# EAGLE design simple-loop-vrs (EAGLE 6.6.0)

## Sheet 1 of 2
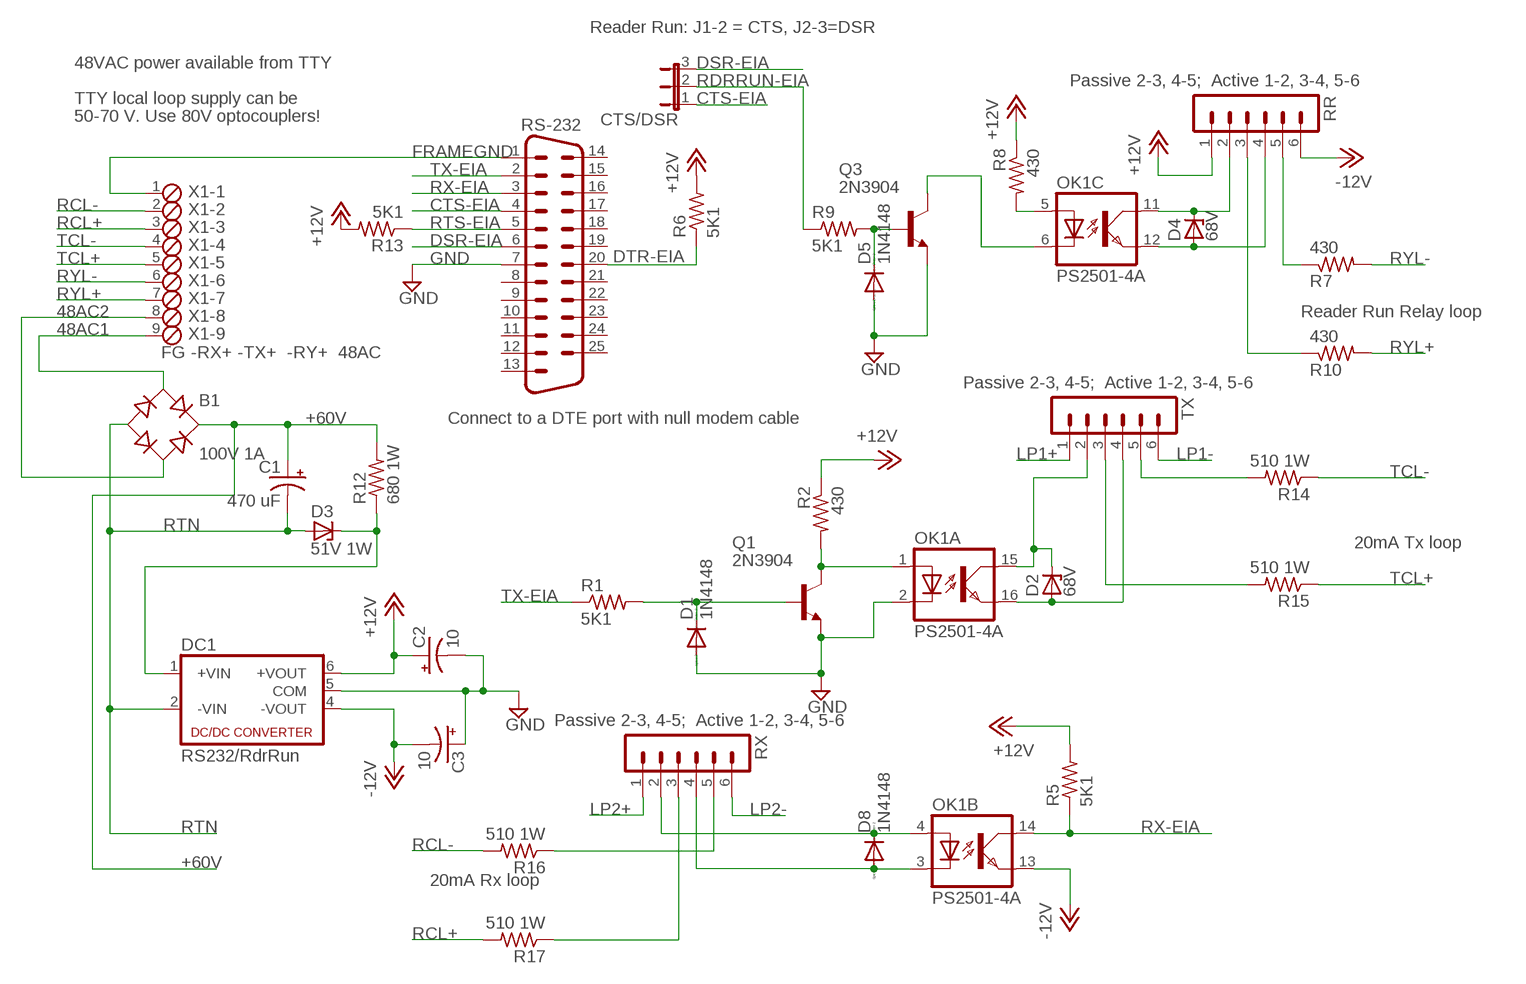
[diagram p0: schematic, sheet 1]

### Parts
B1  100V 1A  RB1A  [RB1A]
C1  470 uF  CPOL-USE7.5-18  [E7,5-18]
C2  10  CPOL-USB45181A  [B45181A]
C3  10  CPOL-USB45181A  [B45181A]
CTS/DSR  JP2E  [JP2]
D1  1N4148  1N4148DO35-10  [DO35-10]
D2  68V  ZENER-DIODEDO41Z10  [DO41Z10]
D3  51V 1W  ZENER-DIODEDO41Z10  [DO41Z10]
D4  68V  ZENER-DIODEDO41Z10  [DO41Z10]
D5  1N4148  1N4148DO35-10  [DO35-10]
D8  1N4148  1N4148DO35-10  [DO35-10]
DC1  RS232/RdrRun  NMA  [NMA]
OK1  PS2501-4A  ILQ1  [DIL16]
Q1  2N3904  [TO92]
Q3  2N3904  [TO92]
R1  5K1  R-US_0207/10  [0207/10]
R2  430  R-US_0207/10  [0207/10]
R5  5K1  R-US_0207/10  [0207/10]
R6  5K1  R-US_0207/10  [0207/10]
R7  430  R-US_0207/10  [0207/10]
R8  430  R-US_0207/10  [0207/10]
R9  5K1  R-US_0207/10  [0207/10]
R10  430  R-US_0207/10  [0207/10]
R12  680 1W  R-US_0817/7V  [P0817V]
R13  5K1  R-US_0207/10  [0207/10]
R14  510 1W  R-US_0817/7V  [P0817V]
R15  510 1W  R-US_0817/7V  [P0817V]
R16  510 1W  R-US_0817/7V  [P0817V]
R17  510 1W  R-US_0817/7V  [P0817V]
RR  MA06-1  [MA06-1]
RS-232  M25H  [M25H]
RX  MA06-1  [MA06-1]
TX  MA06-1  [MA06-1]
X1  FG -RX+ -TX+ -RY+ 48AC  MPT9  [9POL254]

### Nets
48AC1: B1.AC1 X1.9
48AC2: B1.AC2 X1.8
+12V: C2.+ DC1.6(+VOUT) R2.1 R5.2 R6.2 R8.1 R13.2 RR.1
+48VDC: D3.C DC1.1(+VIN) R12.1
+60V: B1.+ C1.+ R12.2 ; also sheet 2
-12V: C3.- DC1.4(-VOUT) OK1.13(B:EMIT) RR.6
CTS-EIA: CTS/DSR.1 RS-232.4
DSR-EIA: CTS/DSR.3 RS-232.6
DTR-EIA: R6.1 RS-232.20
FRAMEGND: RS-232.1 X1.1
GND [GND]: C2.- C3.+ D1.A D5.A DC1.5(COM) OK1.2(A:C) Q1.3(E) Q3.3(E) RS-232.7
LP1+: TX.1 ; also sheet 2
LP1-: TX.6 ; also sheet 2
LP2+: RX.1 ; also sheet 2
LP2-: RX.6 ; also sheet 2
N$1: D8.C OK1.4(B:A) RX.2
N$2: R16.1 RX.5
N$3: D8.A OK1.3(B:C) RX.4
N$4: D2.A OK1.16(A:EMIT) TX.4
N$5: OK1.5(C:A) R8.2
N$6: D2.C OK1.15(A:COL) TX.2
N$7: D1.C Q1.2(B) R1.2
N$8: D4.C OK1.11(C:COL) RR.2
N$9: OK1.1(A:A) Q1.1(C) R2.2
N$10: R10.1 RR.3
N$11: R7.1 RR.5
N$15: OK1.6(C:C) Q3.1(C)
N$16: D5.C Q3.2(B) R9.2
N$19: R14.2 TX.5
N$20: R17.1 RX.3
N$21: R15.2 TX.3
N$22: D4.A OK1.12(C:EMIT) RR.4
RCL+: R17.2 X1.3
RCL-: R16.2 X1.2
RDRRUN-EIA: CTS/DSR.2 R9.1
RTN: B1.- C1.- D3.A DC1.2(-VIN) ; also sheet 2
RTS-EIA: R13.1 RS-232.5
RX-EIA: OK1.14(B:COL) R5.1 RS-232.3
RYL+: R10.2 X1.7
RYL-: R7.2 X1.6
TCL+: R15.1 X1.5
TCL-: R14.1 X1.4
TX-EIA: R1.1 RS-232.2
Unconnected: RS-232.8 RS-232.9 RS-232.10 RS-232.11 RS-232.12 RS-232.13 RS-232.14 RS-232.15 RS-232.16 RS-232.17 RS-232.18 RS-232.19 RS-232.21 RS-232.22 RS-232.23 RS-232.24 RS-232.25

### Notes on the sheet
- Reader Run: J1-2 = CTS, J2-3=DSR
- 48VAC power available from TTY
- Passive 2-3, 4-5;  Active 1-2, 3-4, 5-6
- TTY local loop supply can be
- 50-70 V. Use 80V optocouplers!
- Reader Run Relay loop
- Passive 2-3, 4-5;  Active 1-2, 3-4, 5-6
- Connect to a DTE port with null modem cable
- 20mA Tx loop
- Passive 2-3, 4-5;  Active 1-2, 3-4, 5-6
- 20mA Rx loop

## Sheet 2 of 2
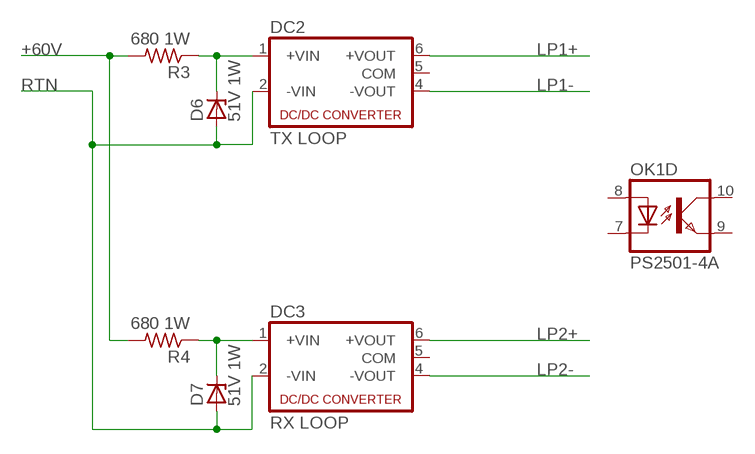
[diagram p1: schematic, sheet 2]

### Parts
D6  51V 1W  ZENER-DIODEDO41Z10  [DO41Z10]
D7  51V 1W  ZENER-DIODEDO41Z10  [DO41Z10]
DC2  TX LOOP  NMA  [NMA]
DC3  RX LOOP  NMA  [NMA]
R3  680 1W  R-US_0817/7V  [P0817V]
R4  680 1W  R-US_0817/7V  [P0817V]

### Nets
+48VDC1: D6.C DC2.1(+VIN) R3.1
+48VDC2: D7.C DC3.1(+VIN) R4.1
+60V: R3.2 R4.2 ; also sheet 1
LP1+: DC2.6(+VOUT) ; also sheet 1
LP1-: DC2.4(-VOUT) ; also sheet 1
LP2+: DC3.6(+VOUT) ; also sheet 1
LP2-: DC3.4(-VOUT) ; also sheet 1
RTN: D6.A D7.A DC2.2(-VIN) DC3.2(-VIN) ; also sheet 1
Unconnected: DC2.5(COM) DC3.5(COM) OK1.7(D:C) OK1.8(D:A) OK1.9(D:EMIT) OK1.10(D:COL)

## Library data of the parts
B1 = rectifier:RB1A: RECTIFIER 1 A
C1-C3 = rcl:CPOL-US: POLARIZED CAPACITOR, American symbol
CTS/DSR = jumper:JP2E: JUMPER
D1 D5 D8 = diode:1N4148: DIODE high speed (Philips)
D2-D4 D6 D7 = diode:ZENER-DIODE: Z-Diode
DC1-DC3 = dc-dc-converter:NMA: DC-DC CONVERTER; MF: C & D TECHNOLOGIES, INC; MPN: NMA0515SC; OC_FARNELL: 1021434; OC_NEWARK: 61K3064
OK1 = optocoupler:ILQ1: SIEMENS OPTO COUPLER; MF: VISHAY/TELEFUNKEN; MPN: ILQ1; OC_FARNELL: 1469501; OC_NEWARK: 88K1954
Q1 Q3 = transistor-npn:2N3904: NPN Transistor
R1-R10 R12-R17 = rcl:R-US_: RESISTOR, American symbol
RR RX TX = con-lstb:MA06-1: PIN HEADER; OC_FARNELL: unknown; OC_NEWARK: unknown
RS-232 = con-subd:M25: SUB-D; OC_FARNELL: unknown; OC_NEWARK: unknown
X1 = con-phoenix-254:MPT9: PHOENIX CONNECTOR; OC_FARNELL: unknown; OC_NEWARK: unknown

## Net classes
1 GND: width 0.508 mm

## Board
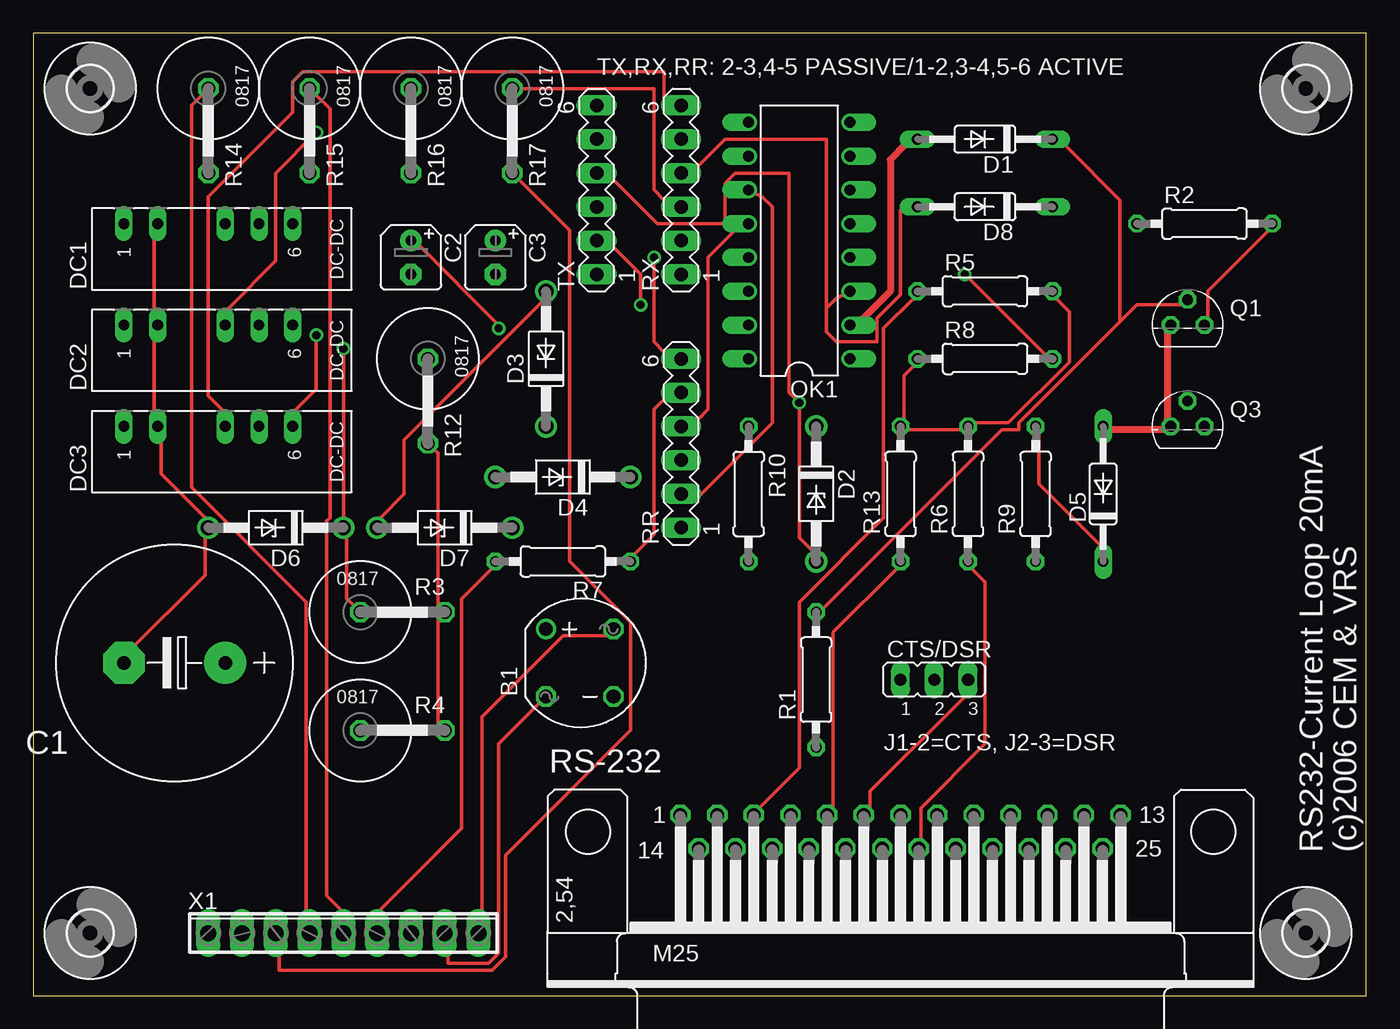
[diagram p2: board, top side]
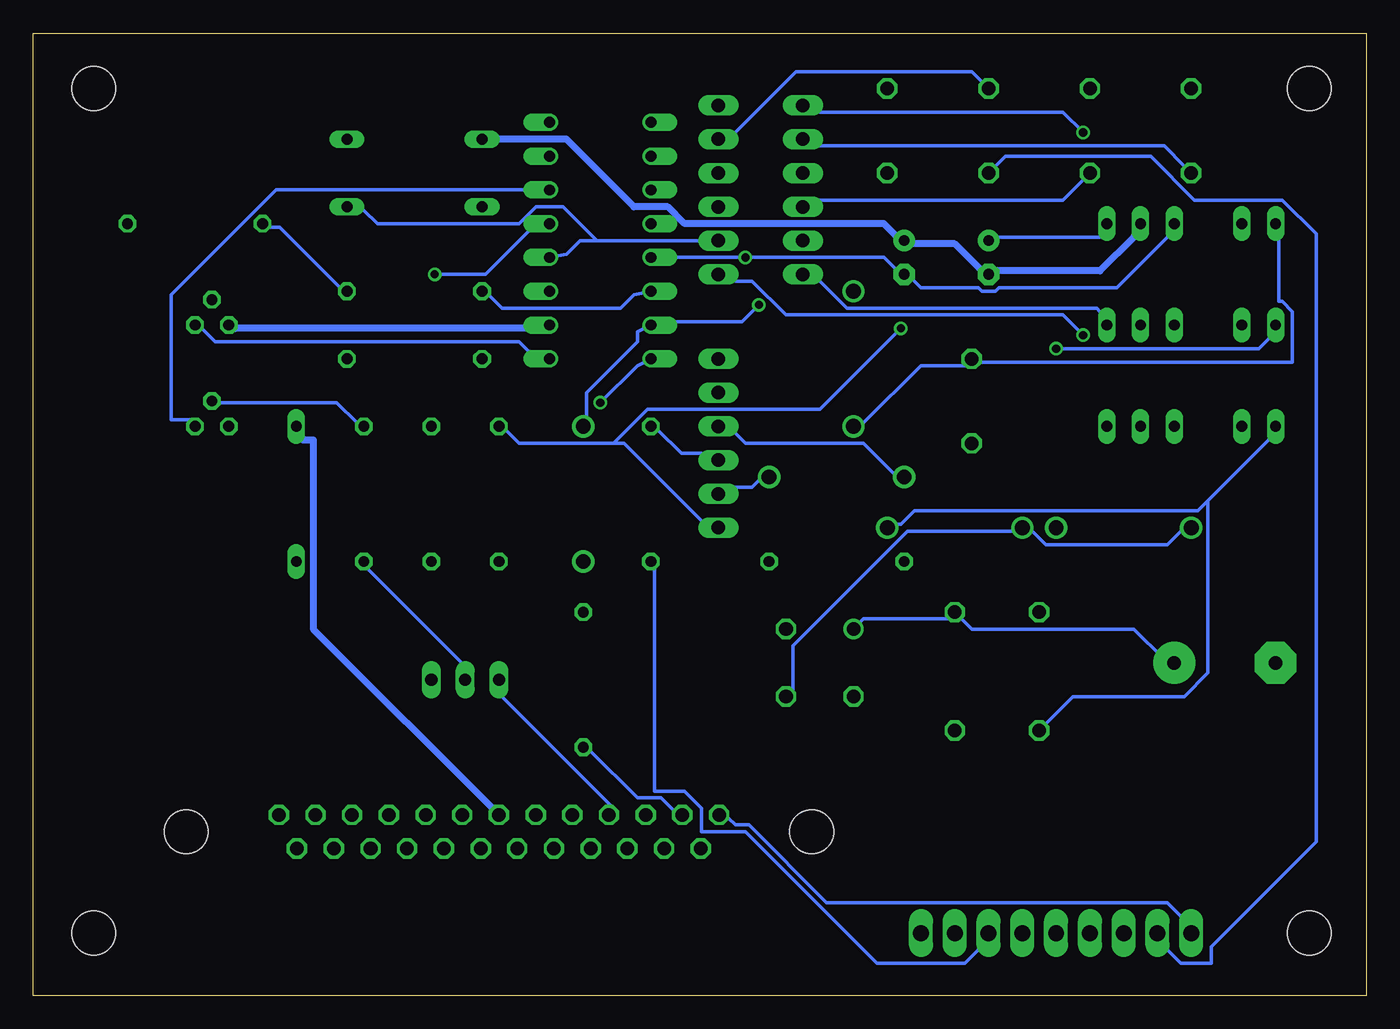
[diagram p3: board, bottom side, seen from below]

Size 100.27 x 72.37 mm. Coordinates in mm from the lower left corner, seen from the top.
Outline: 100.27,0 100.27,72.37 0,72.37 0,0 100.27,0
Copper layers (1*16): Top 0.035mm / dielectric 1.5mm / Bottom 0.035mm
Design rules "10mils *": minimum track width 10mil, minimum drill 24mil, track to track 10mil, track to pad 10mil, pad to pad 10mil, via to via 10mil, smd to smd 10mil, copper to edge 40mil, drill to drill 10mil, minimum pad ring 10mil, minimum via ring 8mil, stop-mask expansion 0mil, vias tented up to drill 0mil, thermal gap 10mil

### Footprints (pad centres in the part's own frame; a part is rotated, then mirrored left to right if it is on the bottom)
RB1A = drill 1.016: + -2.54,2.54 | drill 1.016 octagon: - 2.54,-2.54; AC1 2.54,2.54; AC2 -2.54,-2.54
E7,5-18 = drill 1.016 pad 3.15: + -3.81,0 | drill 1.016 pad 3.15 octagon: - 3.81,0
B45181A = drill 0.813 pad 1.6: + -1.27,0 | drill 0.813 pad 1.6 octagon: - 1.27,0
JP2 = drill 0.914 long: 1 -2.54,0; 2 0,0; 3 2.54,0
DO35-10 = drill 0.813 long: A 5.08,0; C -5.08,0
DO41Z10 = drill 1.118: A 5.08,0; C -5.08,0
NMA = drill 0.813 long: 1 0,6.35; 2 0,3.81; 4 0,-1.27; 5 0,-3.81; 6 0,-6.35
DIL16 = drill 0.813 offset: 1 -8.89,-3.81; 2 -6.35,-3.81; 3 -3.81,-3.81; 4 -1.27,-3.81; 5 1.27,-3.81; 6 3.81,-3.81; 7 6.35,-3.81; 8 8.89,-3.81; 9 8.89,3.81; 10 6.35,3.81; 11 3.81,3.81; 12 1.27,3.81; 13 -1.27,3.81; 14 -3.81,3.81; 15 -6.35,3.81; 16 -8.89,3.81
TO92 = drill 0.813 octagon: 1 1.27,0; 2 0,1.905; 3 -1.27,0
0207/10 = drill 0.813 octagon: 1 -5.08,0; 2 5.08,0
P0817V = drill 1.016 octagon: 1 -5.08,0; 2 1.27,0
MA06-1 = drill 1.016 long: 1 -6.35,0; 2 -3.81,0; 3 -1.27,0; 4 1.27,0; 5 3.81,0; 6 6.35,0
M25H = drill 1.016 octagon: 1 -16.561,1.27; 2 -13.792,1.27; 3 -11.049,1.27; 4 -8.28,1.27; 5 -5.512,1.27; 6 -2.769,1.27; 7 0,1.27; 8 2.769,1.27; 9 5.512,1.27; 10 8.28,1.27; 11 11.049,1.27; 12 13.792,1.27; 13 16.561,1.27; 14 -15.189,-1.27; 15 -12.421,-1.27; 16 -9.652,-1.27; 17 -6.909,-1.27; 18 -4.14,-1.27; 19 -1.372,-1.27; 20 1.372,-1.27; 21 4.14,-1.27; 22 6.909,-1.27; 23 9.652,-1.27; 24 12.421,-1.27; 25 15.189,-1.27 | hole 3.302: 23.52,0; -23.52,0
3,3 = hole 3.3: 0,0
9POL254 = drill 1.2 long: 1 -10.16,0; 2 -7.62,0; 3 -5.08,0; 4 -2.54,0; 5 0,0; 6 2.54,0; 7 5.08,0; 8 7.62,0; 9 10.16,0

### Placement (x,y rotation side)
B1  41.11,25.03 0 top
C1  10.63,25.03 180 top
C2  28.41,55.51 270 top
C3  34.76,55.51 270 top
CTS/DSR  67.78,23.76 0 top
D1  71.59,64.4 180 top
D2  58.89,37.73 270 top
D3  38.57,47.89 90 top
D4  39.84,39 180 top
D5  80.48,37.73 90 top
D6  18.25,35.19 180 top
D7  30.95,35.19 180 top
D8  71.59,59.32 180 top
DC1  13.17,58.05 90 top
DC2  13.17,50.43 90 top
DC3  13.17,42.81 90 top
OK1  57.62,56.78 90 top
Q1  86.83,50.43 0 top
Q3  86.83,42.81 0 top
R1  58.89,23.76 90 top
R2  88.1,58.05 0 top
R3  29.68,28.84 0 top
R4  29.68,19.95 0 top
R5  71.59,52.97 0 top
R6  70.32,37.73 90 top
R7  39.84,32.65 180 top
R8  71.59,47.89 0 top
R9  75.4,37.73 90 top
R10  53.81,37.73 270 top
R12  29.68,42.81 270 top
R13  65.24,37.73 90 top
R14  13.17,63.13 270 top
R15  20.79,63.13 270 top
R16  28.41,63.13 270 top
R17  36.03,63.13 270 top
RR  48.73,41.54 90 top
RS-232  65.24,12.33 0 top
RX  48.73,60.59 90 top
TX  42.38,60.59 90 top
U$1  [3,3]  4.28,68.21 0 top
U$2  [3,3]  4.28,4.71 0 top
U$3  [3,3]  95.72,68.21 0 top
U$4  [3,3]  95.72,4.71 0 top
X1  23.33,4.71 0 top

### Tracks (layer width: path | path; a pad name or v marks a point on that pad's centre or on a via)
48AC1
  Top 0.254: B1.AC1 43.14,27.06 39.84,27.06 33.74,20.97 33.74,6.49 X1.9
48AC2
  Top 0.254: B1.AC2 38.06,21.98 35.01,18.93 35.01,3.19 34.25,2.42 31.2,2.42 31.2,2.93 X1.8
+12V  (via drill 0.61)
  Top 0.254: R8.1 66.26,47.38 65.49,46.62 65.49,43.32 R13.2 65.75,42.56 69.81,42.56 R6.2 70.83,43.06 73.37,43.06 77.94,47.64 77.94,51.45 76.92,52.46 R5.2 | v35.01,50.18 35.01,50.43 28.92,56.53 C2.+
  Bottom 0.254: R5.2 77.18,53.22 81.75,57.8 82.51,57.8 R2.1 | C2.+ 27.9,57.03 20.03,57.03 DC1.6 | 56.6,41.54 63.72,41.54 64.73,42.56 R13.2 | 56.6,41.54 55.84,41.54 50,35.7 RR.1 | v35.01,50.18 41.11,44.08 54.06,44.08 56.6,41.54
+48VDC
  Bottom 0.254: DC1.1 6.57,56.78 6.57,52.21 6.31,52.21 5.55,51.45 5.55,47.64 29.17,47.64 R12.1 30.19,47.38 33.49,47.38 37.81,43.06 D3.C
+48VDC1  (via drill 0.61)
  Top 0.254: v23.33,48.65 23.33,35.95 D6.C 23.58,34.43 23.58,29.86 24.09,29.35 R3.1
  Bottom 0.254: v23.33,48.65 8.09,48.65 7.33,49.41 DC2.1
+48VDC2
  Bottom 0.254: 11.9,37.22 12.66,36.46 34,36.46 35.01,35.44 35.27,35.44 D7.C | 11.9,37.22 7.33,41.79 DC3.1 | R4.1 22.06,22.49 13.68,22.49 11.9,24.27 11.9,37.22
+60V
  Top 0.254: R4.2 30.44,20.46 30.44,28.33 R3.2 30.44,29.35 30.44,40.78 R12.2
  Bottom 0.254: B1.+ 37.81,28.33 31.46,28.33 R3.2 29.68,27.57 17.49,27.57 15.2,25.28 C1.+
-12V  (via drill 0.61)
  Top 0.254: v46.7,55.51 46.7,49.16 47.46,48.4 RR.6
  Bottom 0.254: OK1.13 v46.7,55.51 36.28,55.51 35.27,54.49 C3.- 34.25,53.99 33.49,53.22 29.17,53.22 28.92,52.97 27.9,52.97 27.65,53.22 18.76,53.22 14.95,57.03 DC1.4
CTS-EIA
  Bottom 0.254: CTS/DSR.1 64.99,22.49 56.6,14.11 RS-232.4
DSR-EIA
  Top 0.254: CTS/DSR.3 70.07,22.49 62.95,15.38 62.95,14.11 RS-232.6
DTR-EIA
  Top 0.254: R6.1 70.57,32.14 71.59,31.13 71.59,18.93 66.76,14.11 66.76,11.57 RS-232.20
FRAMEGND
  Bottom 0.254: RS-232.1 47.97,13.35 47.46,12.84 46.44,12.84 40.6,7 14.95,7 13.93,5.98 X1.1
GND
  Top 0.508: OK1.2 62.45,50.94 64.48,52.97 64.48,62.88 65.49,63.89 D1.A | D5.A 80.99,42.56 85.05,42.56 Q3.3 85.31,43.32 85.31,49.92 Q1.3
  Bottom 0.508: DC1.5 17.49,57.03 20.03,54.49 27.9,54.49 C2.- 28.92,54.49 30.95,56.53 34.25,56.53 C3.+ 35.27,57.03 36.28,58.05 51.27,58.05 52.54,59.32 55.08,59.32 60.16,64.4 D1.A | RS-232.7 79.21,27.57 79.21,41.79 79.97,41.79 D5.A | OK1.2 62.7,50.18 85.05,50.18 Q1.3
LP1+
  Bottom 0.254: DC2.6 20.03,51.45 20.28,51.7 39.08,51.7 41.11,53.73 TX.1
LP1-  (via drill 0.61)
  Top 0.254: v21.3,64.91 18.25,61.86 18.25,55.26 14.69,51.7 DC2.4
  Bottom 0.254: v21.3,64.91 22.82,66.43 41.11,66.43 TX.6
LP2+  (via drill 0.61)
  Top 0.254: v21.3,49.67 21.3,45.6 19.77,44.08 DC3.6
  Bottom 0.254: v21.3,49.67 22.82,51.19 43.65,51.19 46.19,53.73 47.46,53.73 RX.1
LP2-
  Top 0.254: DC3.4 14.19,44.08 13.17,45.1 13.17,60.08 19.52,66.43 19.52,68.72 20.28,69.48 47.46,69.48 47.46,67.45 RX.6
N$1
  Bottom 0.254: 57.87,56.78 50,56.78 RX.2 | 57.87,56.78 59.14,56.78 60.16,55.76 OK1.4 | 57.87,56.78 60.41,59.32 62.45,59.32 63.72,58.05 74.38,58.05 75.4,59.07 D8.C
N$2
  Bottom 0.254: R16.1 28.92,68.72 29.68,69.48 42.89,69.48 47.46,64.91 RX.5
N$3
  Top 0.254: 59.65,51.7 60.41,52.46 OK1.3 | 59.65,51.7 59.65,49.92 60.41,49.16 63.46,49.16 63.46,50.94 65.24,52.72 65.24,59.07 D8.A | 59.65,51.7 59.65,64.4 52.03,64.4 50,62.37 RX.4
N$4  (via drill 0.61)
  Top 0.254: D2.A 58.64,33.41 57.62,34.43 v57.62,44.59 57.37,44.84 56.86,45.35 56.86,61.86 52.79,61.86 52.03,61.1 52.03,58.05 46.95,58.05 43.65,61.35 TX.4
  Bottom 0.254: v57.62,44.59 54.83,47.38 OK1.16
N$5  (via drill 0.61)
  Top 0.254: v70.07,54.24 76.16,48.14 R8.2
  Bottom 0.254: v70.07,54.24 66.26,54.24 62.7,57.8 OK1.5
N$6  (via drill 0.61)
  Top 0.254: v45.68,51.95 45.68,54.24 43.65,56.27 TX.2
  Bottom 0.254: D2.C 58.64,43.57 58.64,45.35 54.83,49.16 54.83,49.92 OK1.15 52.54,50.68 46.95,50.68 v45.68,51.95
N$7
  Top 0.254: 81.75,50.68 83.02,51.95 86.32,51.95 Q1.2 | 81.75,50.68 74.13,43.06 74.13,42.56 72.86,42.56 59.4,29.09 R1.2 | 81.75,50.68 81.75,59.83 77.69,63.89 D1.C
N$8
  Top 0.254: OK1.11 54.83,60.08 55.59,59.32 55.59,43.06 50,37.48 RR.2
  Bottom 0.254: D4.C 45.68,38.75 46.19,38.24 47.46,38.24 RR.2
N$9
  Top 0.254: R2.2 92.93,57.54 88.35,52.97 88.35,50.94 Q1.1
  Bottom 0.254: OK1.1 62.7,48.14 63.72,49.16 86.58,49.16 87.59,50.18 Q1.1
N$10
  Bottom 0.254: R10.1 53.3,42.56 51.52,40.78 50,40.78 RR.3
N$11
  Top 0.254: R7.1 45.17,33.16 46.7,34.68 46.7,44.08 47.46,44.84 RR.5
N$15
  Bottom 0.254: OK1.6 62.7,60.59 82,60.59 89.88,52.72 89.88,43.32 88.35,43.32 Q3.1
N$16
  Top 0.254: D5.C 80.23,33.92 75.65,38.49 75.65,42.3 R9.2
  Bottom 0.254: Q3.2 86.32,44.59 77.43,44.59 75.91,43.06 R9.2
N$19
  Bottom 0.254: R14.2 13.68,62.37 15.2,63.89 41.11,63.89 TX.5
N$20
  Top 0.254: R17.1 36.54,68.21 46.7,68.21 46.7,60.59 47.46,59.83 RX.3
N$21
  Bottom 0.254: R15.2 21.3,61.35 22.82,59.83 41.11,59.83 TX.3
N$22
  Top 0.254: OK1.12 52.79,57.54 50.76,55.51 50.76,44.08 50,43.32 RR.4
  Bottom 0.254: D4.A 35.52,39.25 37.81,41.54 46.7,41.54 47.46,42.3 RR.4
RCL+
  Top 0.254: R17.2 36.54,61.35 40.35,57.54 40.35,32.65 44.92,28.08 44.92,19.95 35.52,10.55 35.52,2.93 34.51,1.92 18.5,1.92 18.5,2.93 X1.3
RCL-
  Bottom 0.254: R16.2 27.14,63.13 16.22,63.13 12.92,59.83 6.31,59.83 3.77,57.29 3.77,11.57 11.65,3.69 11.65,2.42 13.93,2.42 14.95,3.44 X1.2
RDRRUN-EIA
  Bottom 0.254: R9.1 75.15,32.14 68.03,25.03 CTS/DSR.2
RTN
  Top 0.254: DC1.2 9.11,56.78 9.11,51.7 DC2.2 9.11,49.16 9.11,44.08 DC3.2 9.61,41.54 9.61,39.25 12.92,35.95 D6.A 12.92,34.43 12.92,31.63 7.07,25.79 C1.- | D3.A 38.32,52.21 27.9,41.79 27.9,37.73 26.12,35.95 D7.A
  Bottom 0.254: B1.- 43.14,23 43.14,26.3 34.51,34.94 26.63,34.94 D7.A 25.11,34.94 24.09,33.92 14.95,33.92 13.93,34.94 D6.A
RTS-EIA
  Top 0.254: R13.1 64.99,32.14 60.16,27.32 60.16,14.11 RS-232.5
RX-EIA
  Top 0.254: RS-232.3 54.57,14.11 57.62,17.16 57.62,29.6 63.97,35.95 63.97,50.18 66.26,52.46 R5.1
  Bottom 0.254: OK1.14 55.08,52.72 56.1,51.7 64.99,51.7 66,52.72 R5.1
RYL+
  Bottom 0.254: R10.2 53.56,32.14 53.56,15.38 51.27,15.38 50,14.11 50,12.33 46.7,12.33 36.79,2.42 30.19,2.42 29.17,3.44 X1.7
RYL-
  Top 0.254: R7.2 34.51,32.14 32.22,29.86 32.22,12.58 26.12,6.49 X1.6
TCL+
  Top 0.254: R15.1 21.3,67.7 22.31,66.69 22.31,35.95 22.06,35.7 22.06,7.5 23.08,6.49 X1.5
TCL-
  Top 0.254: R14.1 12.66,67.7 11.9,66.94 11.9,38.24 20.54,29.6 20.54,6.49 X1.4
TX-EIA
  Bottom 0.254: R1.1 58.38,18.43 54.83,14.87 53.05,14.87 52.03,13.85 RS-232.2

### Text on the board
tNames: TX,RX,RR: 2-3,4-5 PASSIVE/1-2,3-4,5-6 ACTIVE | J1-2=CTS, J2-3=DSR | RS232-Current Loop 20mA | (c)2006 CEM & VRS